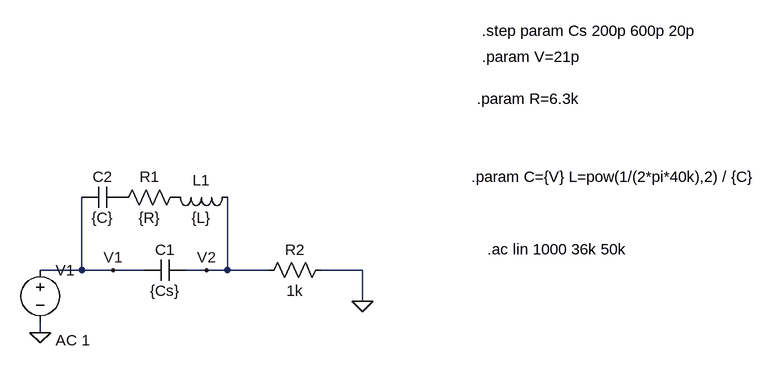
[diagram p0: schematic transducer_characteristics_sweep-cs.asc]
transducer_characteristics_sweep-cs.asc, the LTspice schematic file:
Version 4
SHEET 1 880 680
WIRE -320 256 -320 144
WIRE -320 256 -384 256
WIRE -272 256 -320 256
WIRE -224 256 -272 256
WIRE -128 256 -160 256
WIRE -96 256 -96 144
WIRE -96 256 -128 256
WIRE -32 256 -96 256
WIRE 112 256 48 256
WIRE 112 304 112 256
WIRE -384 352 -384 336
FLAG 112 304 0
FLAG -384 352 0
FLAG -272 256 V1
FLAG -128 256 V2
SYMBOL cap -160 240 R90
WINDOW 0 0 32 VBottom 2
WINDOW 3 32 32 VTop 2
SYMATTR InstName C1
SYMATTR Value {Cs}
SYMBOL cap -256 128 R90
WINDOW 0 0 32 VBottom 2
WINDOW 3 32 32 VTop 2
SYMATTR InstName C2
SYMATTR Value {C}
SYMBOL res -160 128 R90
WINDOW 0 0 56 VBottom 2
WINDOW 3 32 56 VTop 2
SYMATTR InstName R1
SYMATTR Value {R}
SYMBOL ind -80 128 R90
WINDOW 0 5 56 VBottom 2
WINDOW 3 32 56 VTop 2
SYMATTR InstName L1
SYMATTR Value {L}
SYMBOL res 64 240 R90
WINDOW 0 0 56 VBottom 2
WINDOW 3 32 56 VTop 2
SYMATTR InstName R2
SYMATTR Value 1k
SYMBOL voltage -384 240 R0
WINDOW 123 24 124 Left 2
WINDOW 39 0 0 Left 0
SYMATTR Value2 AC 1
SYMATTR InstName V1
SYMATTR Value ""
TEXT 280 112 Left 2 !.param C={V} L=pow(1/(2*pi*40k),2) / {C}
TEXT 296 -72 Left 2 !.param V=21p
TEXT 288 -8 Left 2 !.param R=6.3k
TEXT 296 -112 Left 2 !.step param Cs 200p 600p 20p
TEXT 304 224 Left 2 !.ac lin 1000 36k 50k

The netlist it stands for:
* transducer_characteristics_sweep-cs.asc
C1 V2 V1 {Cs}
C2 P001 V1 {C}
R1 P002 P001 {R}
L1 V2 P002 {L}
R2 0 V2 1k
V1 V1 0 AC 1
.param C={V} L=pow(1/(2*pi*40k),2) / {C}
.param V=21p
.param R=6.3k
.step param Cs 200p 600p 20p
.ac lin 1000 36k 50k
.backanno
.end